# Altium project Project Name.PrjPcb
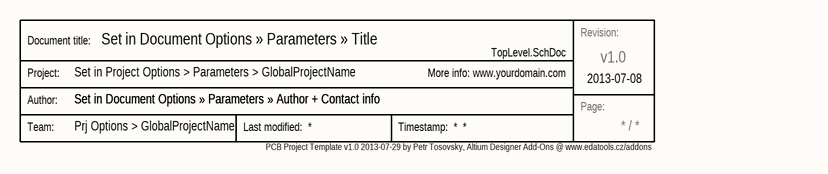
[diagram p0: TopLevel.SchDoc]
GlobalProjectLink: www.yourdomain.com; GlobalProjectName: Set in Project Options > Parameters > GlobalProjectName; GlobalProjectRevision: v1.0; GlobalProjectTeam: Prj Options > GlobalProjectName; GlobalRevisionDate: 2013-07-08
1 sheet, 1 parts. Net scope: global (net labels, ports and power ports of the same name join across sheets).
Board file: 2 Layer PCB template.PcbDoc

## Sheet TopLevel.SchDoc: Set in Document Options » Parameters » Title
size A4; Author: Set in Document Options » Parameters » Author + Contact info

### Parts
Stamp  Stamp  (value not drawn)  (graphical)

### Notes on the sheet
- PCB Project Template v1.0 2013-07-29 by Petr Tosovsky, Altium Designer Add-Ons @ www.edatools.cz/addons <http://www.edatools.cz/addons>
- (in symbol Stamp) Revision:; Document title:; Project:; Author:; Page:; Team: